# Altium project DIGLITE.PrjPcb (part 2 of 2)
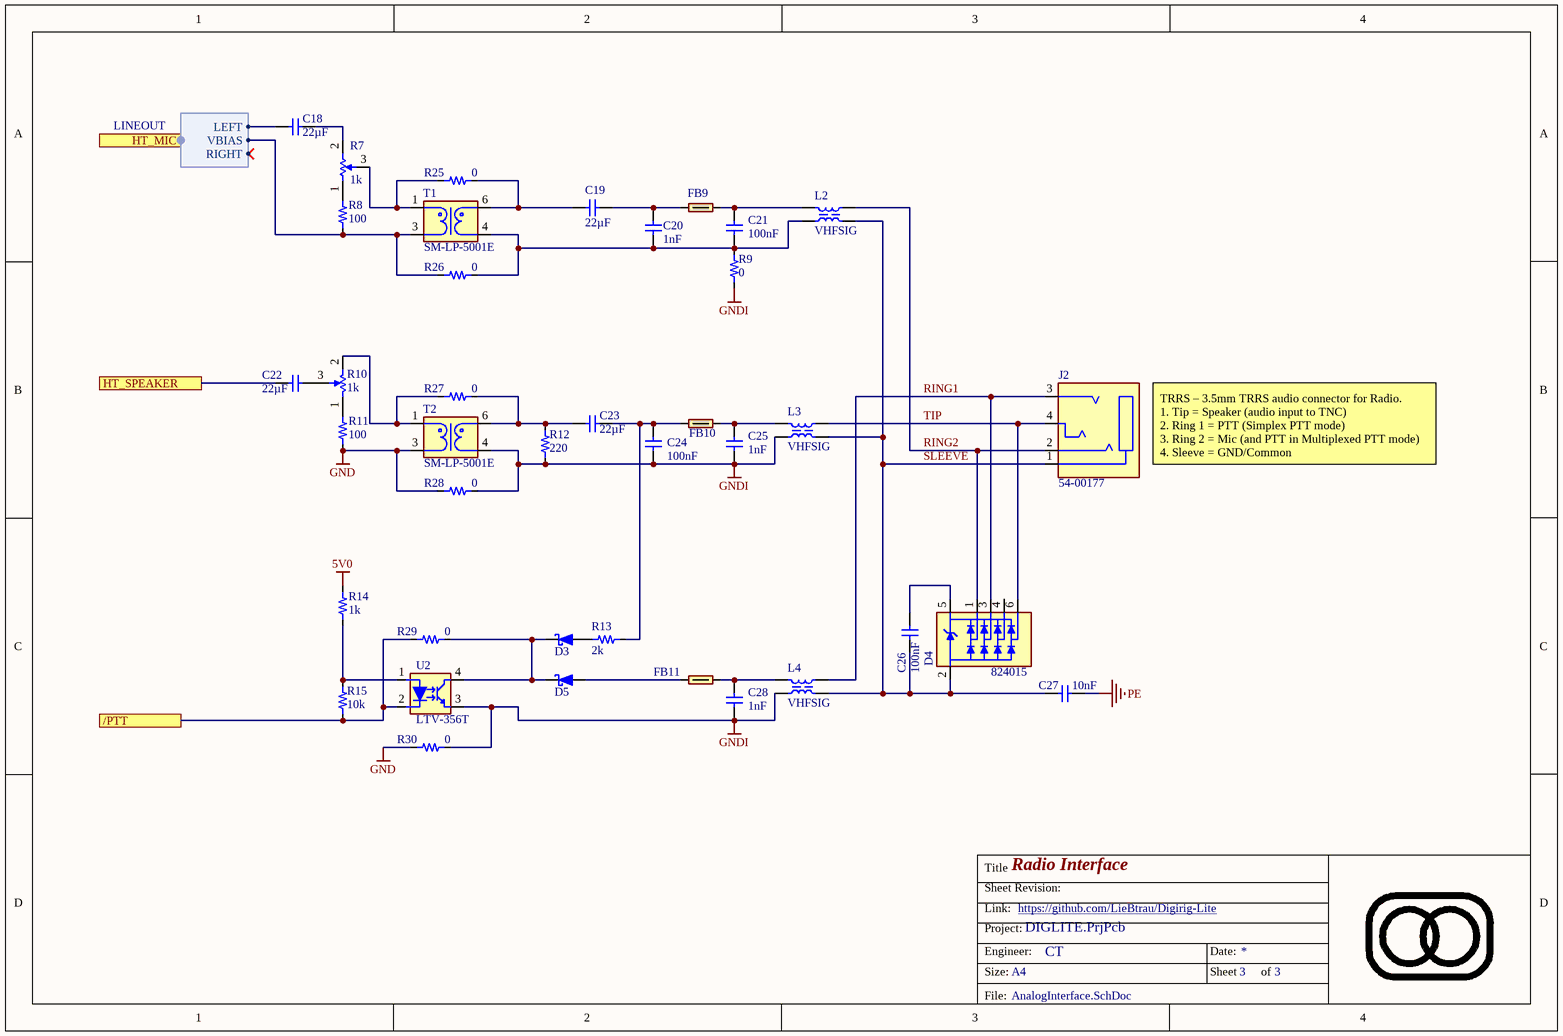
[diagram p3: AnalogInterface.SchDoc]

## Nets that join several sheets
5V0: DIGLITE (9 pins), USB-interface (7 pins), AnalogInterface (R14.1)
GND: DIGLITE (16 pins), USB-interface (35 pins), AnalogInterface (R11.2 R28.1 R30.1 T2.3)
PE: USB-interface (C17.1 J1.MNT), AnalogInterface (C27.1)
HT_MIC: DIGLITE (C32.1 FB13.2), USB-interface (C16.1 FB2.2), AnalogInterface (C18.1)
HT_SPEAKER: DIGLITE (C30.1 FB12.2), USB-interface (C13.1 FB6.2), AnalogInterface (C22.1)
NetC15_1: USB-interface (C15.1 FB4.2), AnalogInterface (R8.2 R26.1 T1.3)
NetJ5_1: DIGLITE (J5.1), USB-interface (U1.21)
NetJ5_2: DIGLITE (J5.2), USB-interface (U1.43)
NetJ5_5: DIGLITE (J5.5), USB-interface (U1.15)
NetJ5_6: DIGLITE (J5.6 Q1.2), USB-interface (U1.13)
NetJ5_10: DIGLITE (J5.10 R20.2), USB-interface (U1.12)
NetQ1_6: DIGLITE (Q1.6), AnalogInterface (R15.1 R29.1 U2.2)

## Assembly variants
A: not fitted R17 R25 R26 R27 R28 R29 R30